# Altium project Arduino-SMPS-LED-Shield-Board.PrjPcb
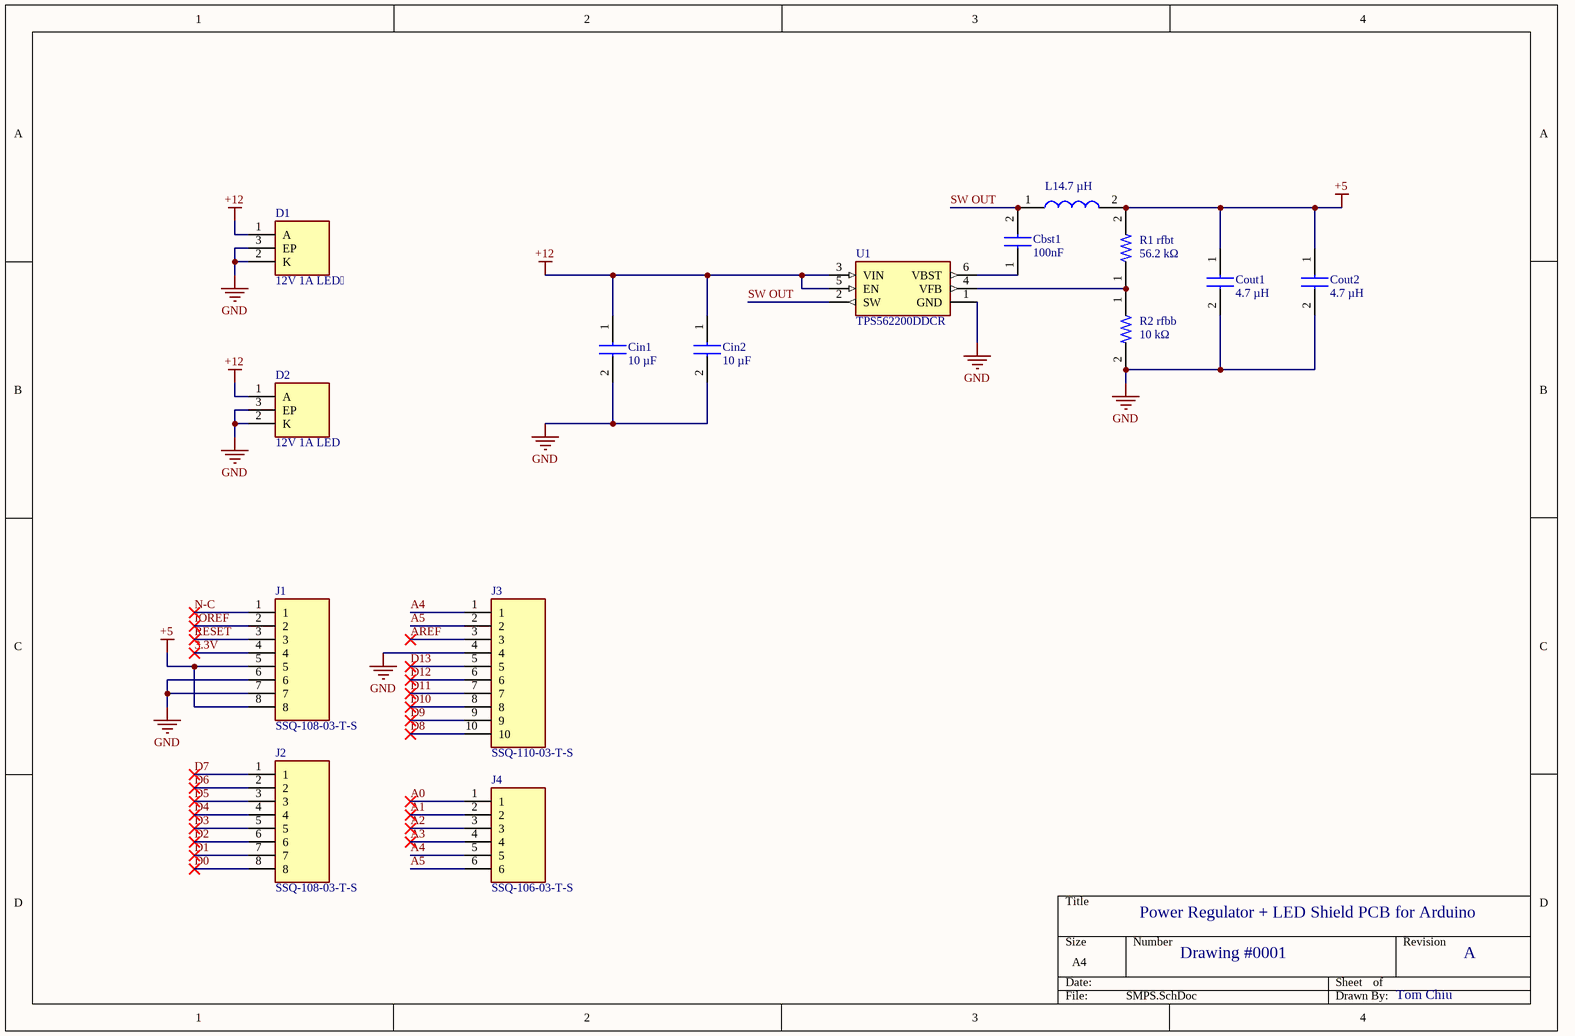
[diagram p0: SMPS.SchDoc]
1 sheet, 15 parts. Net scope: global (net labels, ports and power ports of the same name join across sheets).
Board file: Arduino-SMPS-LED-Shield-Board.PcbDoc

## Sheet SMPS.SchDoc
size A4; SheetNumber: 1; SheetTotal: 1

### Parts
Cbst1  100nF  [CAPC2012X94N]
Cin1  10 µF  [C2012_Commercial]
Cin2  10 µF  [C2012_Commercial]
Cout1  4.7 µH  [C1608_Commercial]
Cout2  4.7 µH  [C1608_Commercial]
D1  12V 1A LED  [MKRAWT0200000D00J2051]
D2  12V 1A LED  [MKRAWT0200000D00J2051]
J1  SSQ-108-03-T-S  [RHDR8W64P254_1X8_2083X241X851P]
J2  SSQ-108-03-T-S  [RHDR8W64P254_1X8_2083X241X851P]
J3  SSQ-110-03-T-S  [RHDR10W64P254_1X10_2591X241X851P]
J4  SSQ-106-03-T-S  [RHDR6W64P254_1X6_1575X241X851P]
L1  4.7 µH  [SRN6045_1]
R1_rfbt  value 56.2 kΩ  [RESC0603X26N]  (hidden comment: RC0201FR-0756K2L)
R2_rfbb  value 10 kΩ  [RESC0603X26N]  (hidden comment: C0201FR-0710KL)
U1  TPS562200DDCR  [SOT95P280X110-6N]

### Nets
+5: Cout1.1 Cout2.1 J1.5 J1.8 L1.2 R1_rfbt.2
+12: Cin1.1 Cin2.1 D1.1(A) D2.1(A) U1.3(VIN) U1.5(EN)
GND: Cin1.2 Cin2.2 Cout1.2 Cout2.2 D1.2(K) D1.3(EP) D2.2(K) D2.3(EP) J1.6 J1.7 J3.4 R2_rfbb.2 U1.1(GND)
3.3V: J1.4
A0: J4.1
A1: J4.2
A2: J4.3
A3: J4.4
A4: J3.1 J4.5
A5: J3.2 J4.6
AREF: J3.3
D0: J2.8
D1: J2.7
D2: J2.6
D3: J2.5
D4: J2.4
D5: J2.3
D6: J2.2
D7: J2.1
D8: J3.10
D9: J3.9
D10: J3.8
D11: J3.7
D12: J3.6
D13: J3.5
IOREF: J1.2
N-C: J1.1
RESET: J1.3
SW OUT: Cbst1.2 L1.1 U1.2(SW)
NetCbst1_1: Cbst1.1 U1.6(VBST)
NetR1_rfbt_1: R1_rfbt.1 R2_rfbb.1 U1.4(VFB)

### Notes on the sheet
- Power Regulator + LED Shield PCB for Arduino
- Drawing #0001
- A
- Tom Chiu

### Library data of the parts
Cbst1 = 08053C104KAT2A: Capacitor; Manufacturer_Name: AVX; Datasheet Link: http://datasheets.avx.com/X7RDielectric.pdf; Height: 0.94mm; Manufacturer_Part_Number: 08053C104KAT2A; Mouser Part Number: 581-08053C104K; Mouser Price/Stock: https://www.mouser.co.uk/ProductDetail/AVX/08053C104KAT2A?qs=EihRZLdKnF2GcTBzDkE%2FiQ%3D%3D; Arrow Part Number: 08053C104KAT2A; Arrow Price/Stock: https://www.arrow.com/en/products/08053c104kat2a/avx
Cin1 Cin2 = C2012X5R1V106K085AC: Capacitor; Manufacturer_Name: TDK; Datasheet Link: https://product.tdk.com/system/files/dam/doc/product/capacitor/ceramic/mlcc/catalog/mlcc_commercial_general_en.pdf; Height: 0.75mm; Manufacturer_Part_Number: C2012X5R1V106K085AC; Mouser Part Number: 810-C2012X5R1V106K0C; Mouser Price/Stock: https://www.mouser.co.uk/ProductDetail/TDK/C2012X5R1V106K085AC?qs=6JAMGB%252BEdky%252BlYMcTLhFyA%3D%3D; Arrow Part Number: C2012X5R1V106K085AC; Arrow Price/Stock: https://www.arrow.com/en/products/c2012x5r1v106k085ac/tdk?region=nac
Cout1 Cout2 = C1608X5R1A226M080AC: Capacitor; Manufacturer_Name: TDK; Datasheet Link: https://product.tdk.com/system/files/dam/doc/product/capacitor/ceramic/mlcc/catalog/mlcc_commercial_general_en.pdf; Height: 0.9mm; Manufacturer_Part_Number: C1608X5R1A226M080AC; Mouser Part Number: 810-C1608X5R1A226M; Mouser Price/Stock: https://www.mouser.co.uk/ProductDetail/TDK/C1608X5R1A226M080AC?qs=dfay7wIA1uED3Fb1o4f9Dg%3D%3D; Arrow Part Number: C1608X5R1A226M080AC; Arrow Price/Stock: https://www.arrow.com/en/products/c1608x5r1a226m080ac/tdk?region=nac
D1 = MKRAWT-02-0000-0D00J2051: LED; Manufacturer_Name: Wolfspeed; Datasheet Link: https://componentsearchengine.com/Datasheets/2/MKRAWT-02-0000-0D00J2051.pdf; Height: 4.21mm; Manufacturer_Part_Number: MKRAWT-02-0000-0D00J2051; Mouser Part Number: 941-MKRAWT20D00J2051; Mouser Price/Stock: https://www.mouser.co.uk/ProductDetail/Cree-LED/MKRAWT-02-0000-0D00J2051?qs=sVgt%2FnWVh7Z5XLS8l5jBtA%3D%3D; Arrow Part Number: MKRAWT-02-0000-0D00J2051; Arrow Price/Stock: https://www.arrow.com/en/products/mkrawt-02-0000-0d00j2051/cree-led?region=nac
D2 = CMP-011-000000-1: LED Uni-Color White 6200K 65 2-Pin SMD EP T/R; Manufacturer_Name: Wolfspeed; Manufacturer_Part_Number: MKRAWT-02-0000-0D00J2051; Mouser Price/Stock: https://www.mouser.co.uk/ProductDetail/Cree-LED/MKRAWT-02-0000-0D00J2051?qs=sVgt%2FnWVh7Z5XLS8l5jBtA%3D%3D; Datasheet Link: https://componentsearchengine.com/Datasheets/2/MKRAWT-02-0000-0D00J2051.pdf; Design Item ID: MKRAWT-02-0000-0D00J2051; Mouser Part Number: 941-MKRAWT20D00J2051; Source: SamacSys.SchLib; Arrow Part Number: MKRAWT-02-0000-0D00J2051; Arrow Price/Stock: https://www.arrow.com/en/products/mkrawt-02-0000-0d00j2051/cree-led?region=nac; Height: 4.21mm
J1 J2 = SSQ-108-03-T-S: Connector; Manufacturer_Name: SAMTEC; Datasheet Link: http://suddendocs.samtec.com/prints/ssq-1xx-xx-xxx-x-xx-xxx-xx-x-mkt.pdf; Height: 8.51mm; Manufacturer_Part_Number: SSQ-108-03-T-S; Mouser Part Number: 200-SSQ10803TS; Mouser Price/Stock: https://www.mouser.co.uk/ProductDetail/Samtec/SSQ-108-03-T-S?qs=rU5fayqh%252BE3sJVWDTx5zyQ%3D%3D; Arrow Part Number: SSQ-108-03-T-S; Arrow Price/Stock: https://www.arrow.com/en/products/ssq-108-03-t-s/samtec?region=nac
J3 = SSQ-110-03-T-S: Connector; Manufacturer_Name: SAMTEC; Datasheet Link: http://suddendocs.samtec.com/prints/ssq-1xx-xx-xxx-x-xx-xxx-xx-x-mkt.pdf; Height: 8.51mm; Manufacturer_Part_Number: SSQ-110-03-T-S; Mouser Part Number: 200-SSQ11003TS; Mouser Price/Stock: https://www.mouser.co.uk/ProductDetail/Samtec/SSQ-110-03-T-S?qs=rU5fayqh%252BE0uAJE8UTgxfA%3D%3D; Arrow Part Number: SSQ-110-03-T-S; Arrow Price/Stock: https://www.arrow.com/en/products/ssq-110-03-t-s/samtec?region=nac
J4 = SSQ-106-03-T-S: Connector; Manufacturer_Name: SAMTEC; Datasheet Link: http://suddendocs.samtec.com/prints/ssq-1xx-xx-xxx-x-xx-xxx-xx-x-mkt.pdf; Height: 8.51mm; Manufacturer_Part_Number: SSQ-106-03-T-S; Mouser Part Number: 200-SSQ10603TS; Mouser Price/Stock: https://www.mouser.co.uk/ProductDetail/Samtec/SSQ-106-03-T-S?qs=rU5fayqh%252BE1MgKYVKa8USw%3D%3D; Arrow Part Number: SSQ-106-03-T-S; Arrow Price/Stock: https://www.arrow.com/en/products/ssq-106-03-t-s/samtec?region=nac
L1 = SRN6045-4R7Y: Inductor; Manufacturer_Name: Bourns; Datasheet Link: https://www.bourns.com/data/global/pdfs/SRN6045.pdf; Manufacturer_Part_Number: SRN6045-4R7Y; Mouser Part Number: 652-SRN6045-4R7Y; Mouser Price/Stock: https://www.mouser.co.uk/ProductDetail/Bourns/SRN6045-4R7Y?qs=opBjA1TV902tB4tumIiZhg%3D%3D; Arrow Part Number: SRN6045-4R7Y; Arrow Price/Stock: https://www.arrow.com/en/products/srn6045-4r7y/bourns?region=nac
R1_rfbt = CMP-017-000000-2: RES SMD 56.2K OHM 1% 1/20W 0201; Source: RC0201FR-0756K2L.SchLib; Package: None; Component Type: Standard; Availability: Unavailable; Pin Count: 2; Design Item ID: RC0201FR-0756K2L; Price: None; MP: RC0201FR-0756K2L
R2_rfbb = CMP-015-000000-1: 10 kOhms Â±1% 0.05W, 1/20W Chip Resistor 0201 (0603 Metric) Moisture Resistant Thick Film; MF: Yageo; Check_prices: https://www.snapeda.com/parts/RC0201FR-0710KL/Yageo/view-part/?ref=eda; SnapEDA_Link: https://www.snapeda.com/parts/RC0201FR-0710KL/Yageo/view-part/?ref=snap; Source: RC0201FR-0710KL.SchLib; Availability: In Stock; Design Item ID: RC0201FR-0710KL; Price: None; Component Type: Standard; Purchase-URL: https://pricing.snapeda.com/search/part/RC0201FR-0710KL/?ref=eda; Package: 0201 Yageo; Pin Count: 2; MP: RC0201FR-0710KL
U1 = CMP-013-000000-2: 17 V Input; Manufacturer_Name: Texas Instruments; Arrow Price/Stock: https://www.arrow.com/en/products/tps562200ddcr/texas-instruments?region=nac; Design Item ID: TPS562200DDCR; Source: SamacSys.SchLib; Mouser Part Number: 595-TPS562200DDCR; Manufacturer_Part_Number: TPS562200DDCR; Mouser Price/Stock: https://www.mouser.co.uk/ProductDetail/Texas-Instruments/TPS562200DDCR?qs=7wMBv%2Ftbz9Jdis0htpD4wA%3D%3D; Height: 1.1mm; Arrow Part Number: TPS562200DDCR; Datasheet Link: http://www.ti.com/lit/gpn/tps562200